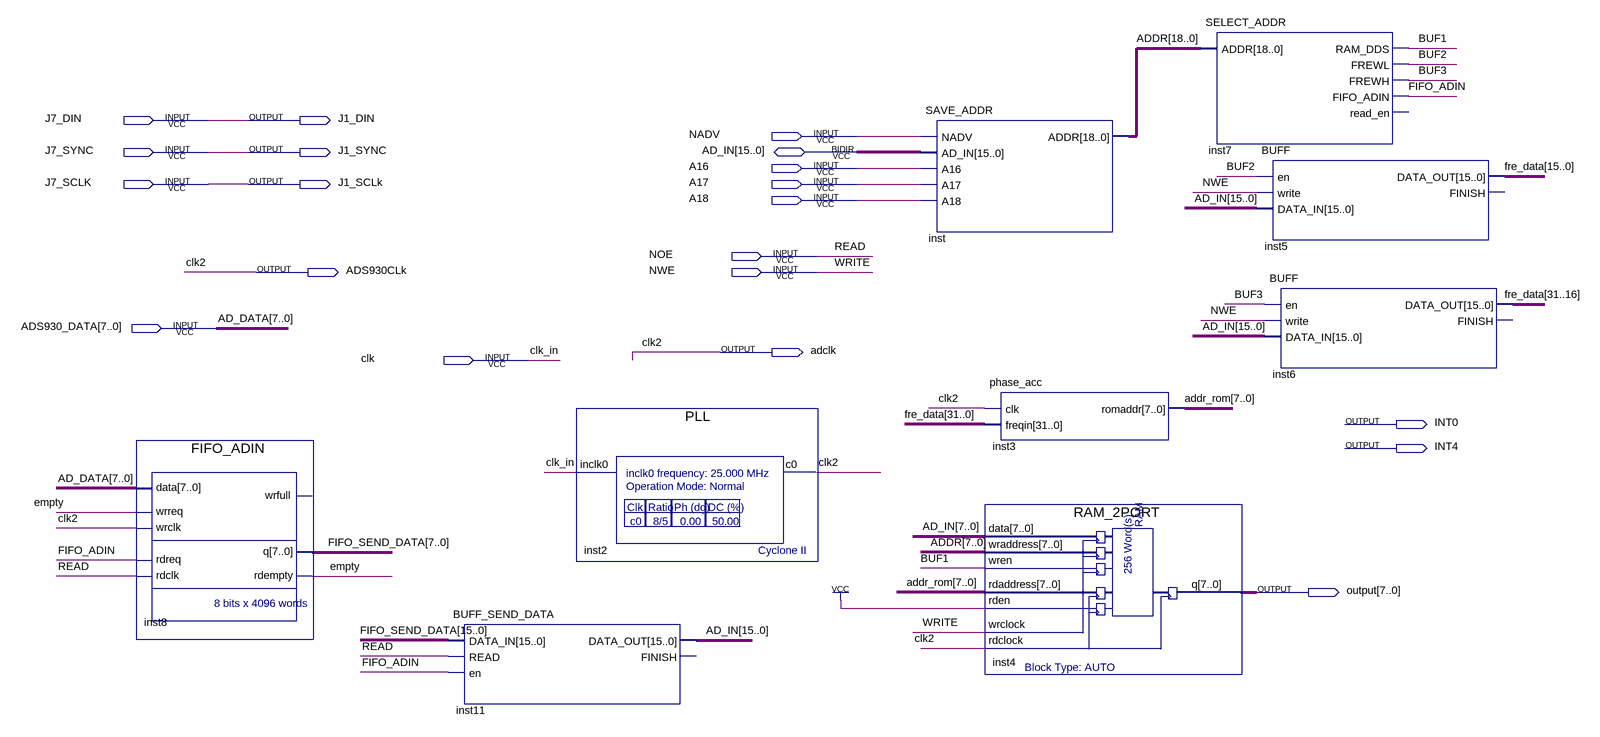
[diagram p0: schematic sheet]
// Quartus schematic FPGA_EP2C.bdf as structural Verilog: 9 symbols, 20 pins
module FPGA_EP2C (
  input  J7_DIN,
  input  NADV,
  input  J7_SYNC,
  input  A16,
  input  J7_SCLK,
  input  A17,
  input  A18,
  input  NOE,
  input  NWE,
  input  [7:0] ADS930_DATA,
  input  clk,
  inout  [15:0] AD_IN,
  output J1_DIN,
  output J1_SYNC,
  output J1_SCLk,
  output ADS930CLk,
  output adclk,
  output INT0,
  output INT4,
  output [7:0] \output 
);

  wire BUF1, BUF2, BUF3, empty, FIFO_ADIN;
  wire [7:0] addr_rom;
  wire [15:0] FIFO_SEND_DATA;
  wire [18:0] ADDR;
  wire [31:0] fre_data;

  FIFO_ADIN inst8 (
    .data(ADS930_DATA), .wrreq(empty), .wrclk(adclk), .rdreq(FIFO_ADIN), .rdclk(NOE),
    .q(FIFO_SEND_DATA[7:0]), .rdempty(empty));  // open: wrfull
  BUFF_SEND_DATA inst11 (.DATA_IN(FIFO_SEND_DATA), .READ(NOE), .en(FIFO_ADIN), .DATA_OUT(AD_IN));  // open: FINISH
  PLL inst2 (.inclk0(clk), .c0(adclk));
  SAVE_ADDR inst (.NADV(NADV), .AD_IN(AD_IN), .A16(A16), .A17(A17), .A18(A18), .ADDR(ADDR));
  phase_acc inst3 (.clk(adclk), .freqin(fre_data), .romaddr(addr_rom));
  RAM_2PORT inst4 (
    .data(AD_IN[7:0]), .wraddress(ADDR[7:0]), .wren(BUF1), .rdaddress(addr_rom), .rden(1'b1), .wrclock(NWE),
    .rdclock(adclk), .q(\output ));
  SELECT_ADDR inst7 (.ADDR(ADDR), .RAM_DDS(BUF1), .FREWL(BUF2), .FREWH(BUF3), .FIFO_ADIN(FIFO_ADIN));  // open: read_en
  BUFF inst5 (.en(BUF2), .write(NWE), .DATA_IN(AD_IN), .DATA_OUT(fre_data[15:0]));  // open: FINISH
  BUFF inst6 (.en(BUF3), .write(NWE), .DATA_IN(AD_IN), .DATA_OUT(fre_data[31:16]));  // open: FINISH

  assign ADS930CLk = adclk;
  assign J1_DIN = J7_DIN;
  assign J1_SCLk = J7_SCLK;
  assign J1_SYNC = J7_SYNC;

  // Other names for the same wires on the sheet: AD_DATA[7:0] = ADS930_DATA; clk2 = adclk; clk_in = clk; READ = NOE;
  //   WRITE = NWE
endmodule
